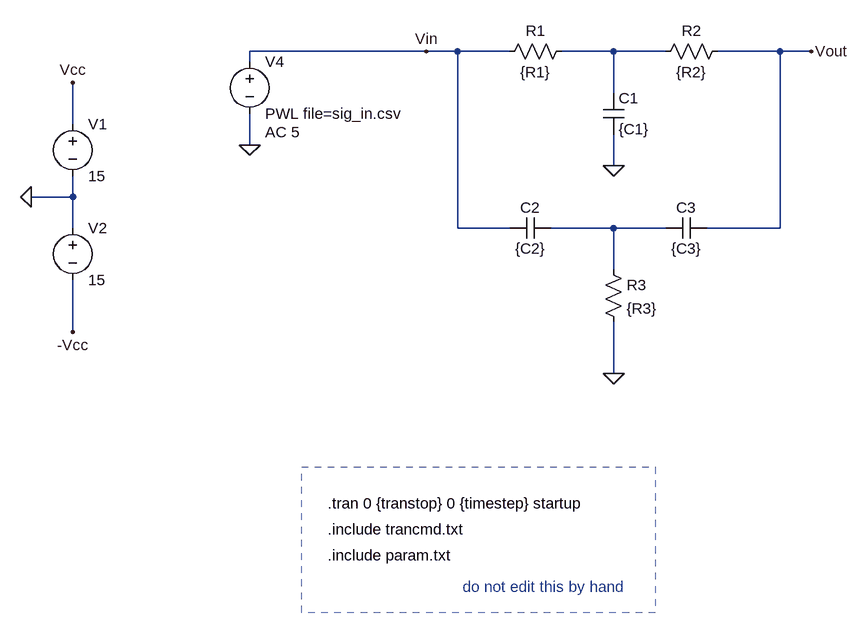
[diagram p0: schematic A11_Notch_Pasivo.asc]
A11_Notch_Pasivo.asc, the LTspice schematic file:
Version 4
SHEET 1 1752 900
WIRE 80 -128 -192 -128
WIRE 128 -128 80 -128
WIRE 208 -128 128 -128
WIRE 368 -128 288 -128
WIRE 448 -128 368 -128
WIRE 624 -128 528 -128
WIRE 672 -128 624 -128
WIRE -192 -112 -192 -128
WIRE 368 -64 368 -128
WIRE -464 -16 -464 -80
WIRE -192 16 -192 -32
WIRE 368 48 368 0
WIRE -464 96 -464 64
WIRE -464 96 -528 96
WIRE -464 144 -464 96
WIRE 128 144 128 -128
WIRE 208 144 128 144
WIRE 368 144 272 144
WIRE 448 144 368 144
WIRE 624 144 624 -128
WIRE 624 144 512 144
WIRE 368 208 368 144
WIRE -464 304 -464 224
WIRE 368 368 368 288
FLAG 80 -128 Vin
FLAG -528 96 0
FLAG -464 -80 Vcc
FLAG -464 304 -Vcc
FLAG 672 -128 Vout
FLAG 368 48 0
FLAG 368 368 0
FLAG -192 16 0
SYMBOL res 304 -144 R90
WINDOW 0 0 56 VBottom 2
WINDOW 3 32 56 VTop 2
SYMATTR InstName R1
SYMATTR Value {R1}
SYMBOL cap 352 -64 R0
SYMATTR InstName C1
SYMATTR Value {C1}
SYMBOL cap 208 160 R270
WINDOW 0 32 32 VTop 2
WINDOW 3 0 32 VBottom 2
SYMATTR InstName C2
SYMATTR Value {C2}
SYMBOL voltage -464 -32 R0
WINDOW 123 0 0 Left 0
WINDOW 39 0 0 Left 0
SYMATTR InstName V1
SYMATTR Value 15
SYMBOL voltage -464 128 R0
WINDOW 123 0 0 Left 0
WINDOW 39 0 0 Left 0
SYMATTR InstName V2
SYMATTR Value 15
SYMBOL res 544 -144 R90
WINDOW 0 0 56 VBottom 2
WINDOW 3 32 56 VTop 2
SYMATTR InstName R2
SYMATTR Value {R2}
SYMBOL cap 512 128 R90
WINDOW 0 0 32 VBottom 2
WINDOW 3 32 32 VTop 2
SYMATTR InstName C3
SYMATTR Value {C3}
SYMBOL res 352 192 R0
SYMATTR InstName R3
SYMATTR Value {R3}
SYMBOL voltage -192 -128 R0
WINDOW 123 24 124 Left 2
WINDOW 39 0 0 Left 0
SYMATTR Value2 AC 5
SYMATTR InstName V4
SYMATTR Value PWL file=sig_in.csv
TEXT -72 568 Left 2 !.tran 0 {transtop} 0 {timestep} startup
TEXT -72 648 Left 2 !.include param.txt
TEXT -72 608 Left 2 !.include trancmd.txt
TEXT 136 696 Left 2 ;do not edit this by hand
RECTANGLE Normal 432 736 -112 512 2

The netlist it stands for:
* A11_Notch_Pasivo.asc
R1 N001 Vin {R1}
C1 N001 0 {C1}
C2 Vin N002 {C2}
V1 Vcc 0 15
V2 0 -Vcc 15
R2 Vout N001 {R2}
C3 Vout N002 {C3}
R3 N002 0 {R3}
V4 Vin 0 PWL file=sig_in.csv AC 5
.tran 0 {transtop} 0 {timestep} startup
.include param.txt
.include trancmd.txt
* do not edit this by hand
.backanno
.end

* Results of the author's LTspice run, read from the files saved beside the schematic
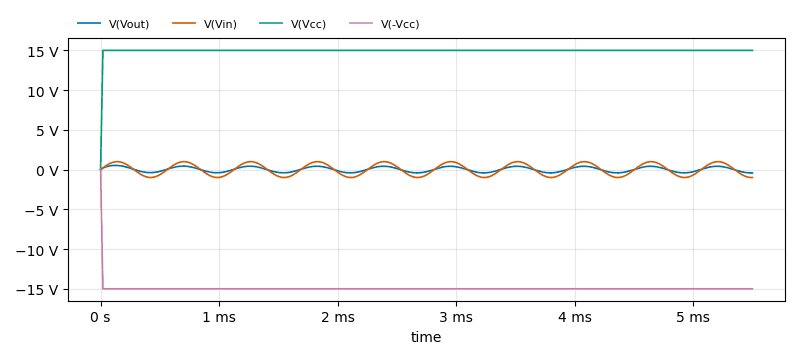
[diagram p1: Transient Analysis of A11_Notch_Pasivo.asc, plotted from the saved traces]
* Transient Analysis, 1 run:
*   V(Vout): min -417.8 mV, max 523.4 mV, average 15.12 mV, rms 300.2 mV, last -412.1 mV
*   V(Vin): min -1 V, max 1 V, average 14.52 mV, rms 707.4 mV, last -994.2 mV
*   V(Vcc): min 0 V, max 15 V, average 14.97 V, rms 14.98 V, last 15 V
*   V(-Vcc): min -15 V, max 0 V, average -14.97 V, rms 14.98 V, last -15 V